# EAGLE design expresscard-breakout (EAGLE 8.5.0)
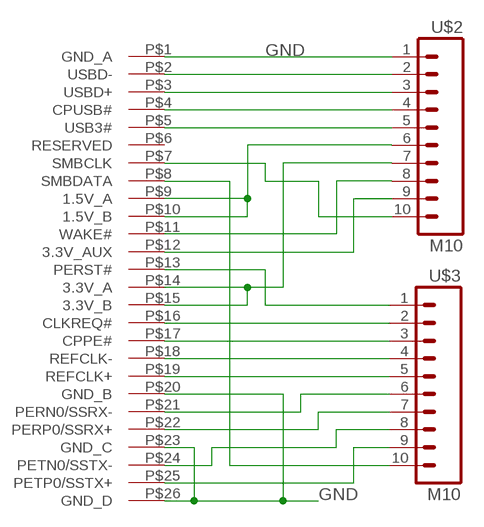
[diagram p0: schematic, sheet 1]

## Parts
U$1  EXPRESSCARD34  [EXPRESSCARD34]
U$2  M10  [1X10-SMD-NOHOLES]
U$3  M10  [1X10-SMD-NOHOLES]

## Nets
GND: U$1.P$1(GND_A) U$1.P$20(GND_B) U$1.P$23(GND_C) U$1.P$26(GND_D) U$2.1
N$1: U$1.P$9(1.5V_A) U$1.P$10(1.5V_B) U$2.6
N$3: U$1.P$2(USBD-) U$2.2
N$4: U$1.P$3(USBD+) U$2.3
N$5: U$1.P$4(CPUSB#) U$2.4
N$6: U$1.P$5(USB3#) U$2.5
N$7: U$1.P$14(3.3V_A) U$1.P$15(3.3V_B) U$2.7
N$8: U$1.P$11(WAKE#) U$2.8
N$9: U$1.P$12(3.3V_AUX) U$2.9
N$10: U$1.P$7(SMBCLK) U$2.10
N$11: U$1.P$8(SMBDATA) U$3.10
N$12: U$1.P$13(PERST#) U$3.1
N$13: U$1.P$16(CLKREQ#) U$3.2
N$14: U$1.P$17(CPPE#) U$3.3
N$15: U$1.P$18(REFCLK-) U$3.4
N$16: U$1.P$19(REFCLK+) U$3.5
N$17: U$1.P$21(PERN0/SSRX-) U$3.6
N$18: U$1.P$22(PERP0/SSRX+) U$3.7
N$19: U$1.P$24(PETN0/SSTX-) U$3.8
N$20: U$1.P$25(PETP0/SSTX+) U$3.9
Unconnected: U$1.P$6(RESERVED)

## Library data of the parts
U$1 = HokieGeek:EXPRESSCARD34
U$2 U$3 = HokieGeek:M10

## Board
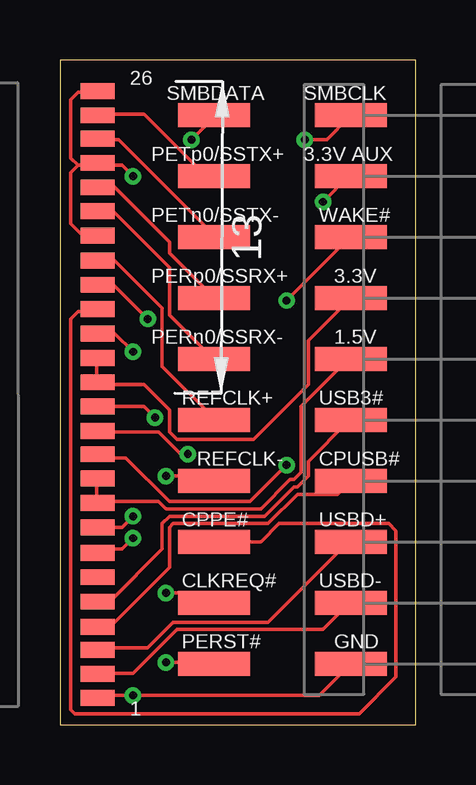
[diagram p1: board, top side]
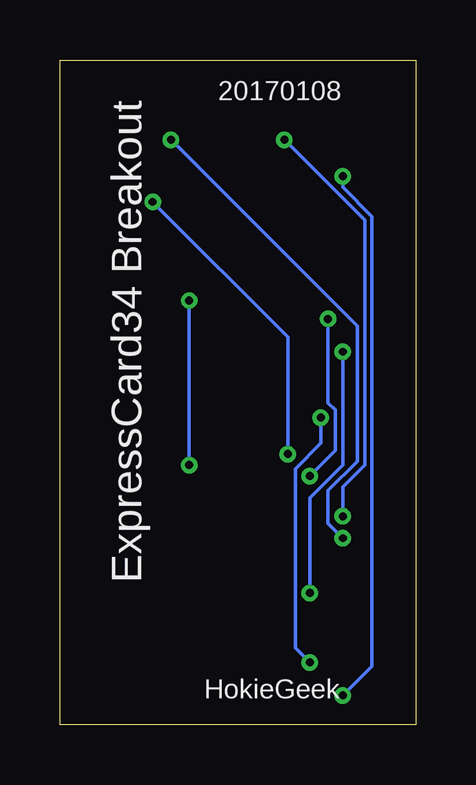
[diagram p2: board, bottom side, seen from below]

Size 14.84 x 27.71 mm. Coordinates in mm from the lower left corner, seen from the top.
Outline: 0,0 14.84,0 14.84,27.71 0,27.71 0,0
Copper layers (1*16): Top 0.0356mm / dielectric 1.5011mm / Bottom 0.0356mm
Design rules "LaenPCBOrder": minimum track width 6mil, minimum drill 13mil, track to track 6mil, track to pad 6mil, pad to pad 6mil, via to via 6mil, smd to smd 6mil, copper to edge 15mil, drill to drill 6mil, minimum pad ring 7mil, minimum via ring 7mil, stop-mask expansion 3mil, vias tented up to drill 0mil, thermal gap 10mil

### Footprints (pad centres in the part's own frame; a part is rotated, then mirrored left to right if it is on the bottom)
EXPRESSCARD34 = smd 1.422 x 0.66: P$1 -0.066,-12.856; P$2 -0.066,-11.858; P$3 -0.066,-10.861; P$4 -0.066,-9.898; P$5 -0.066,-8.842; P$6 -0.066,-7.825; P$7 -0.066,-6.81; P$8 -0.066,-5.744; P$9 -0.066,-4.728; P$10 -0.066,-3.712; P$11 -0.066,-2.696; P$12 -0.066,-1.73; P$13 -0.066,-0.714; P$14 -0.066,0.302; P$15 -0.066,1.318; P$16 -0.066,2.334; P$17 -0.066,3.35; P$18 -0.066,4.366; P$19 -0.066,5.382; P$20 -0.066,6.423; P$21 -0.066,7.439; P$22 -0.066,8.43; P$23 -0.066,9.446; P$24 -0.066,10.462; P$25 -0.066,11.427; P$26 -0.066,12.443
1X10-SMD-NOHOLES = smd 1 x 3: 1 -11.43,5; 2 -8.89,5; 3 -6.35,5; 4 -3.81,5; 5 -1.27,5; 6 1.27,5; 7 3.81,5; 8 6.35,5; 9 8.89,5; 10 11.43,5

### Placement (x,y rotation side)
U$1  1.64,13.97 0 top
U$2  17.14,13.97 90 top
U$3  11.43,13.97 90 top

### Tracks (layer width: path | path; a pad name or v marks a point on that pad's centre or on a via)
GND  (via drill 0.33)
  Top 0.152: 0.76,23.32 0.46,23.01 0.46,20.88 0.91,20.42 1.52,20.42 U$1.P$20 | 0.76,23.32 1.52,23.32 U$1.P$23 | 0.76,23.32 0.46,23.62 0.46,26.06 0.76,26.36 1.52,26.36 U$1.P$26 | 0.76,23.32 U$1.P$23 | U$1.P$1 1.68,1.22 v3.05,1.22 10.82,1.22 12.04,2.44 U$2.1 | v3.05,22.86 2.59,23.32 1.68,23.32 U$1.P$23
  Bottom 0.152: v3.05,22.86 3.05,22.4 1.83,21.18 1.83,2.44 v3.05,1.22
N$1
  Top 0.152: U$1.P$10 1.52,10.21 1.52,9.3 U$1.P$9 1.68,9.3 4.12,9.3 4.42,8.99 8.38,8.99 9.6,10.21 9.75,10.21 10.06,10.52 10.06,13.26 12.04,15.24 U$2.6
N$3
  Top 0.152: U$1.P$2 1.68,2.13 3.05,2.13 4.88,3.96 10.97,3.96 12.04,5.03 U$2.2
N$4
  Top 0.152: U$1.P$3 1.68,3.2 3.66,3.2 4.72,4.27 8.69,4.27 12.04,7.62 U$2.3
N$5
  Top 0.152: U$1.P$4 1.68,4.27 2.29,4.27 4.57,6.55 4.57,8.23 4.72,8.38 8.69,8.38 9.91,9.6 11.58,9.6 12.04,10.06 U$2.4
N$6
  Top 0.152: U$1.P$5 1.68,5.18 2.13,5.18 4.27,7.32 4.27,8.38 4.57,8.69 8.53,8.69 9.75,9.91 9.91,9.91 10.36,10.36 10.36,10.97 12.04,12.65 U$2.5
N$7
  Top 0.152: U$1.P$15 1.52,15.24 1.52,14.33 U$1.P$14 1.68,14.17 3.5,14.17 4.57,13.11 4.57,12.19 4.88,11.89 8.08,11.89 10.36,14.17 10.36,16 12.04,17.68 U$2.7
N$8  (via drill 0.33)
  Top 0.152: v9.45,10.82 7.92,9.3 4.57,9.3 2.74,11.12 1.68,11.12 U$1.P$11 | v9.45,17.68 12.04,20.27 U$2.8
  Bottom 0.152: v9.45,17.68 v9.45,10.82
N$9  (via drill 0.33)
  Top 0.152: v5.33,11.28 5.03,11.28 4.12,12.19 1.68,12.19 U$1.P$12 | v10.97,21.79 12.04,22.86 U$2.9
  Bottom 0.152: v5.33,11.28 5.33,16.15 v10.97,21.79
N$10  (via drill 0.33)
  Top 0.152: v3.05,7.77 2.59,7.32 1.68,7.32 U$1.P$7 | v10.21,24.38 11.12,24.38 12.04,25.3 U$2.10
  Bottom 0.152: v3.05,7.77 3.66,8.38 3.66,9.75 2.44,10.97 2.44,16.61 v10.21,24.38
N$11  (via drill 0.33)
  Top 0.152: v3.05,8.69 2.59,8.23 1.68,8.23 U$1.P$8 | v5.49,24.38 6.4,25.3 U$3.10
  Bottom 0.152: v3.05,8.69 3.05,9.91 2.13,10.82 2.13,21.03 v5.49,24.38
N$12  (via drill 0.33)
  Top 0.152: v3.96,12.8 3.5,13.26 1.68,13.26 U$1.P$13 | v4.42,2.59 6.4,2.59 U$3.1
  Bottom 0.152: v3.96,12.8 3.96,11.73 5.03,10.67 5.03,3.2 v4.42,2.59
N$13  (via drill 0.33)
  Top 0.152: v3.05,15.54 2.29,16.31 1.68,16.31 U$1.P$16 | v4.42,5.49 6.1,5.49 6.4,5.18 U$3.2
  Bottom 0.152: v3.05,15.54 3.05,10.82 4.42,9.45 v4.42,5.49
N$14
  Top 0.152: U$3.3 8.38,7.62 9.14,8.38 13.72,8.38 14.02,8.08 14.02,1.98 12.5,0.46 0.61,0.46 0.46,0.61 0.46,16.92 0.76,17.22 1.52,17.22 U$1.P$17
N$15  (via drill 0.33)
  Top 0.152: v3.66,16.92 2.29,18.29 1.68,18.29 U$1.P$18 | v4.42,10.36 6.25,10.36 6.4,10.21 U$3.4
  Bottom 0.152: v3.66,16.92 3.66,13.41 3.35,13.11 3.35,11.43 v4.42,10.36
N$16
  Top 0.152: U$1.P$19 1.68,19.36 2.29,19.36 4.27,17.37 4.27,14.94 6.4,12.8 U$3.5
N$17
  Top 0.152: U$1.P$21 1.68,21.34 2.29,21.34 4.57,19.05 4.57,17.07 6.4,15.24 U$3.6
N$18
  Top 0.152: U$1.P$22 1.68,22.4 2.29,22.4 4.57,20.12 4.57,19.66 6.4,17.83 U$3.7
N$19
  Top 0.152: U$1.P$24 1.68,24.38 2.44,24.38 6.4,20.42 U$3.8
N$20
  Top 0.152: U$3.9 6.1,22.86 3.5,25.45 1.68,25.45 U$1.P$25

### Text on the board
tPlace: SMBDATA | SMBCLK | PETp0/SSTX+ | 3.3V AUX | PETn0/SSTX- | WAKE# | PERp0/SSRX+ | 3.3V | PERn0/SSRX- | 1.5V | REFCLK+ | USB3# | REFCLK- | CPUSB# | CPPE# | USBD+ | CLKREQ# | USBD- | PERST# | GND
bPlace: 20170108 | ExpressCard34 Breakout | HokieGeek